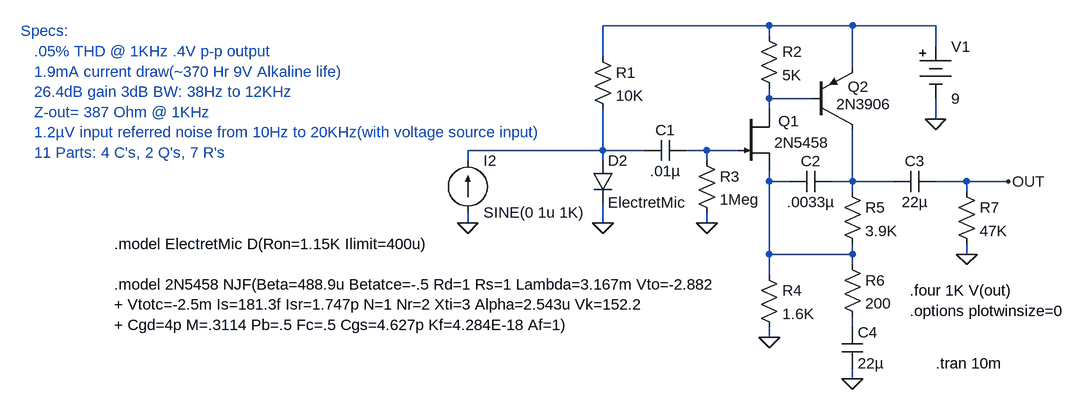
[diagram p0: schematic HandsFreePreamp.asc]
HandsFreePreamp.asc, the LTspice schematic file:
Version 4
SHEET 1 2492 744
WIRE 208 -208 -48 -208
WIRE 336 -208 208 -208
WIRE 464 -208 336 -208
WIRE 208 -192 208 -208
WIRE 464 -176 464 -208
WIRE -48 -160 -48 -208
WIRE 336 -144 336 -208
WIRE 208 -96 208 -112
WIRE 272 -96 208 -96
WIRE 208 -80 208 -96
WIRE 464 -64 464 -96
WIRE -48 -16 -48 -80
WIRE -48 -16 -256 -16
WIRE 16 -16 -48 -16
WIRE 112 -16 80 -16
WIRE 160 -16 112 -16
WIRE -256 0 -256 -16
WIRE -48 0 -48 -16
WIRE 112 0 112 -16
WIRE 208 32 208 16
WIRE 240 32 208 32
WIRE 336 32 336 -48
WIRE 336 32 304 32
WIRE 400 32 336 32
WIRE 512 32 464 32
WIRE 576 32 512 32
WIRE 336 48 336 32
WIRE 512 48 512 32
WIRE -256 96 -256 80
WIRE -48 96 -48 64
WIRE 112 96 112 80
WIRE 208 144 208 32
WIRE 336 144 336 128
WIRE 336 144 208 144
WIRE 512 144 512 128
WIRE 336 160 336 144
WIRE 208 176 208 144
WIRE 336 256 336 240
WIRE 208 272 208 256
WIRE 336 336 336 320
FLAG 464 -64 0
FLAG -256 96 0
FLAG 512 144 0
FLAG 576 32 OUT
FLAG 112 96 0
FLAG 208 272 0
FLAG 336 336 0
FLAG -48 96 0
SYMBOL njf 160 -80 R0
WINDOW 0 62 19 Left 2
WINDOW 3 56 52 Left 2
SYMATTR InstName Q1
SYMATTR Value 2N5458
SYMBOL pnp 272 -48 M180
WINDOW 0 57 66 Left 2
WINDOW 3 39 39 Left 2
SYMATTR InstName Q2
SYMATTR Value 2N3906
SYMBOL cap 80 -32 R90
WINDOW 0 0 32 VBottom 2
WINDOW 3 32 32 VTop 2
SYMATTR InstName C1
SYMATTR Value .01µ
SYMBOL cap 304 16 R90
WINDOW 0 0 32 VBottom 2
WINDOW 3 32 32 VTop 2
SYMATTR InstName C2
SYMATTR Value .0033µ
SYMBOL cap 400 16 M90
WINDOW 0 0 32 VBottom 2
WINDOW 3 32 32 VTop 2
SYMATTR InstName C3
SYMATTR Value 22µ
SYMBOL cap 320 256 R0
SYMATTR InstName C4
SYMATTR Value 22µ
SYMBOL res -64 -176 R0
SYMATTR InstName R1
SYMATTR Value 10K
SYMBOL res 192 -208 R0
SYMATTR InstName R2
SYMATTR Value 5K
SYMBOL res 96 -16 R0
SYMATTR InstName R3
SYMATTR Value 1Meg
SYMBOL res 192 160 R0
SYMATTR InstName R4
SYMATTR Value 1.6K
SYMBOL res 320 32 R0
SYMATTR InstName R5
SYMATTR Value 3.9K
SYMBOL res 320 144 R0
SYMATTR InstName R6
SYMATTR Value 200
SYMBOL res 496 32 R0
SYMATTR InstName R7
SYMATTR Value 47K
SYMBOL current -256 80 M180
WINDOW 0 24 80 Left 2
WINDOW 3 24 0 Left 2
WINDOW 123 24 -42 Left 2
WINDOW 39 24 -21 Left 2
SYMATTR InstName I2
SYMATTR Value SINE(0 1u 1K)
SYMBOL diode -64 0 R0
SYMATTR InstName D2
SYMATTR Value ElectretMic
SYMBOL Misc\\battery 464 -192 R0
SYMATTR InstName V1
SYMATTR Value 9
TEXT 464 312 Left 2 !.tran 10m
TEXT 424 200 Left 2 !.four 1K V(out)\n.options plotwinsize=0
TEXT -944 -200 Left 2 ;Specs:\n   .05% THD @ 1KHz .4V p-p output\n   1.9mA current draw(~370 Hr 9V Alkaline life)\n   26.4dB gain 3dB BW: 38Hz to 12KHz\n   Z-out= 387 Ohm @ 1KHz\n   1.2µV input referred noise from 10Hz to 20KHz(with voltage source input)\n   11 Parts: 4 C's, 2 Q's, 7 R's
TEXT -800 128 Left 2 !.model ElectretMic D(Ron=1.15K Ilimit=400u)\n \n.model 2N5458 NJF(Beta=488.9u Betatce=-.5 Rd=1 Rs=1 Lambda=3.167m Vto=-2.882\n+ Vtotc=-2.5m Is=181.3f Isr=1.747p N=1 Nr=2 Xti=3 Alpha=2.543u Vk=152.2\n+ Cgd=4p M=.3114 Pb=.5 Fc=.5 Cgs=4.627p Kf=4.284E-18 Af=1)

The netlist it stands for:
* HandsFreePreamp.asc
J§Q1 N002 N004 N005 2N5458
Q2 N006 N002 N001 0 2N3906
C1 N004 N003 .01µ
C2 N006 N005 .0033µ
C3 N006 OUT 22µ
C4 N007 0 22µ
R1 N001 N003 10K
R2 N001 N002 5K
R3 N004 0 1Meg
R4 N005 0 1.6K
R5 N006 N005 3.9K
R6 N005 N007 200
R7 OUT 0 47K
I2 0 N003 SINE(0 1u 1K)
D2 N003 0 ElectretMic
V1 N001 0 9
.model D D
.lib standard.dio
.model NPN NPN
.model PNP PNP
.lib standard.bjt
.model NJF NJF
.model PJF PJF
.lib standard.jft
.tran 10m
.four 1K V(out)
.options plotwinsize=0
* Specs:
*    .05% THD @ 1KHz .4V p-p output
*    1.9mA current draw(~370 Hr 9V Alkaline life)
*    26.4dB gain 3dB BW: 38Hz to 12KHz
*    Z-out= 387 Ohm @ 1KHz
*    1.2µV input referred noise from 10Hz to 20KHz(with voltage source input)
*    11 Parts: 4 C's, 2 Q's, 7 R's
.model ElectretMic D(Ron=1.15K Ilimit=400u)
.model 2N5458 NJF(Beta=488.9u Betatce=-.5 Rd=1 Rs=1 Lambda=3.167m Vto=-2.882
+ Vtotc=-2.5m Is=181.3f Isr=1.747p N=1 Nr=2 Xti=3 Alpha=2.543u Vk=152.2
+ Cgd=4p M=.3114 Pb=.5 Fc=.5 Cgs=4.627p Kf=4.284E-18 Af=1)
.backanno
.end